# EAGLE schematic dc26 (EAGLE 9.0.1)

## Sheet 1 of 7
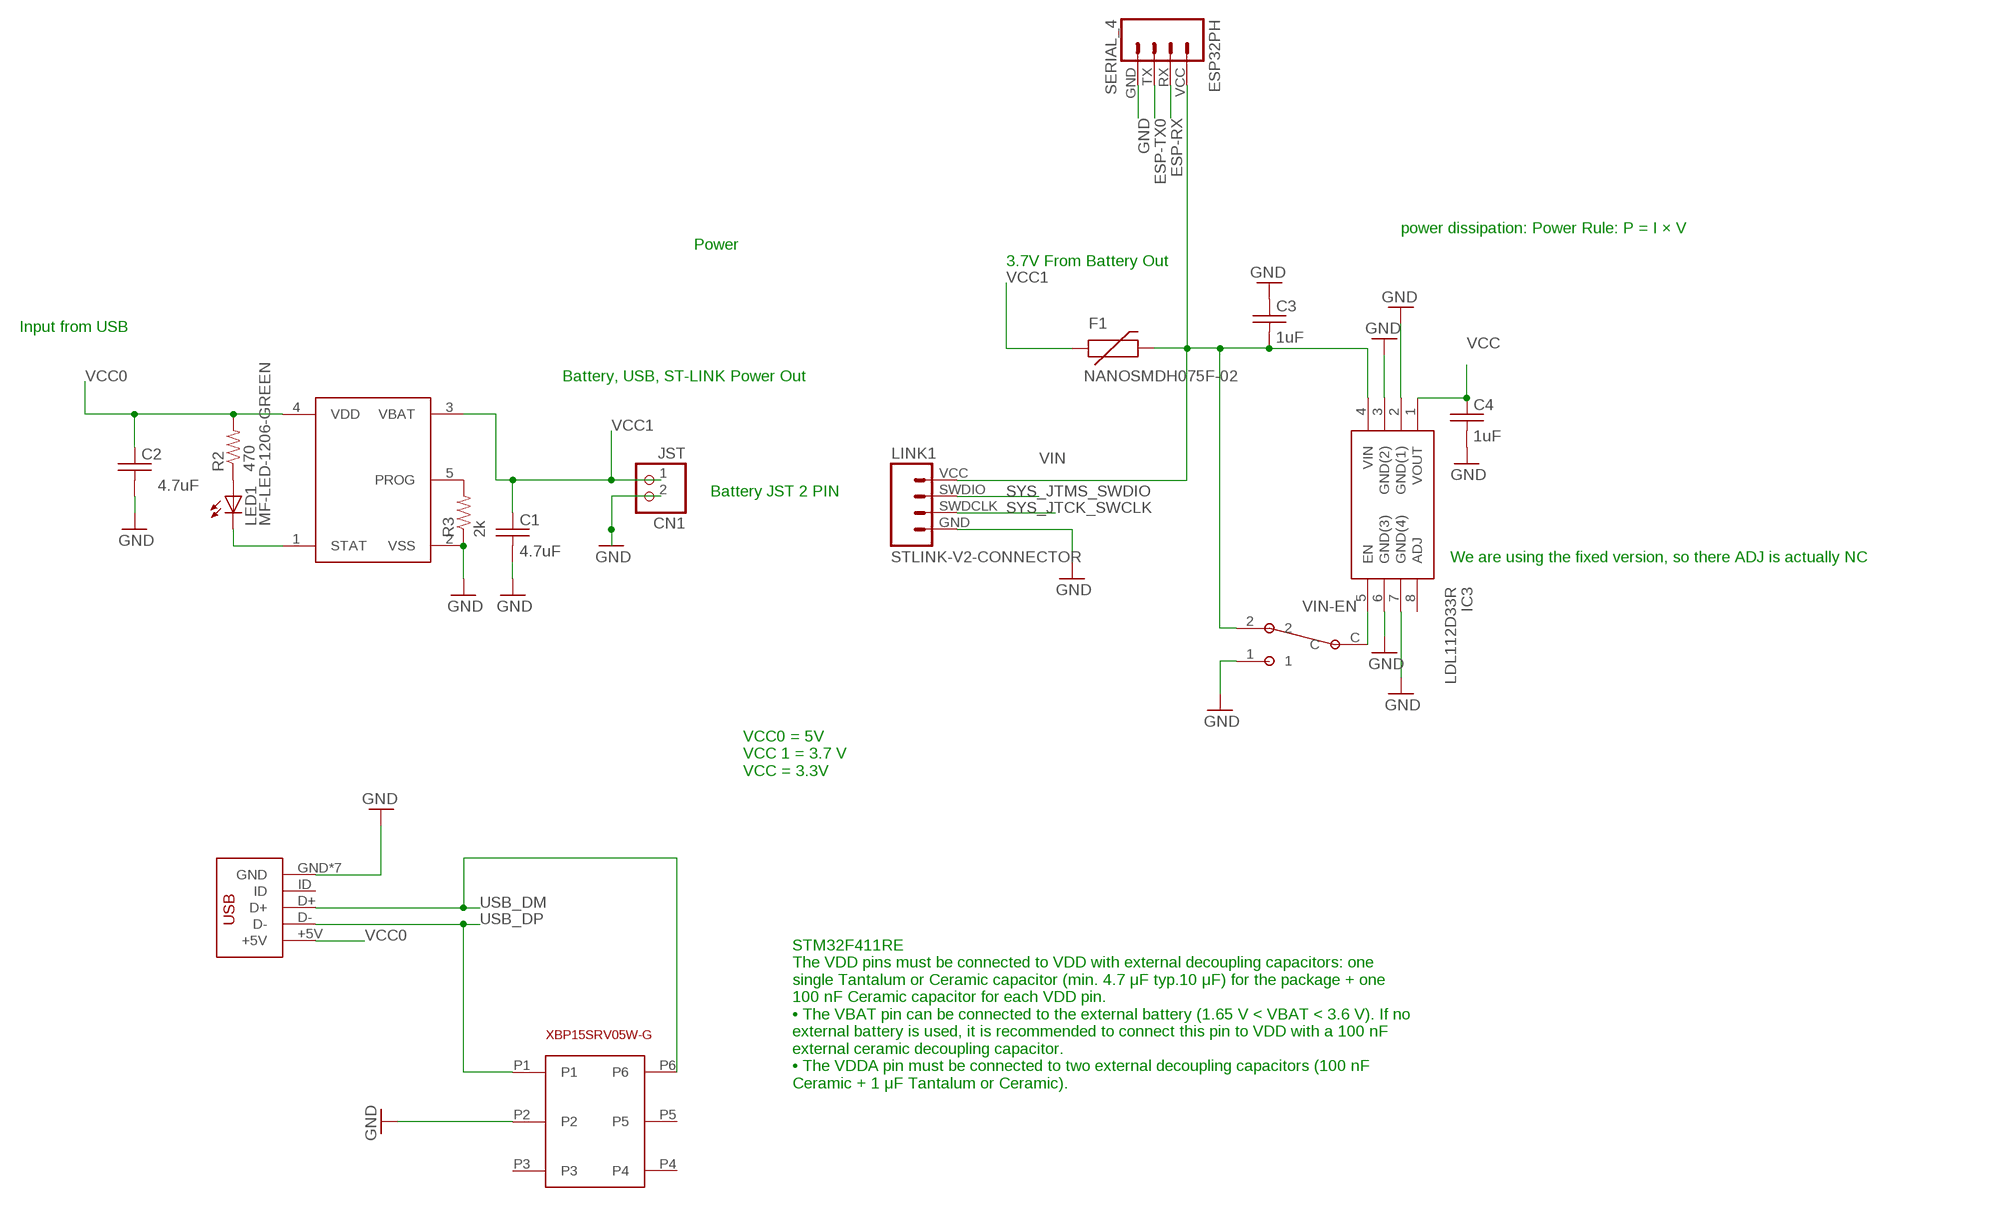
[diagram p0: schematic, sheet 1]

### Parts
C1  4.7uF  C-USC0805  [C0805]
C2  4.7uF  C-USC0805  [C0805]
C3  1uF  C-USC0805  [C0805]
C4  1uF  C-USC0805  [C0805]
CHARGE  MCP73831  DS21984E  [SOT23-5]
CN1  JST  JST_2PIN-THM-RA  [JST-PH-2-THM-RA]
ESP32PH  SERIAL_4  [SERIAL_HEADER_4]
F1  NANOSMDH075F-02  PTCSMD  [PTC-1206]
IC3  LDL112D33R  [SOIC127P600X175-8N]
LED1  MF-LED-1206-GREEN  LED1206  [LED-1206]
LINK1  STLINK-V2-CONNECTOR  [1X04]
P1  SPDT_SSAJ120100  SWITCH_SPDT  [SPDT_SSAJ120100]
R2  470  RESISTOR0805-RES  [0805]
R3  2k  RESISTOR0805-RES  [0805]
U$17  XBP15SRV05W-G  [SOT-26P-XBP15SRV05W-G]
USB  DX4R005JJ2DX4R005JJ2  [DX4R005JJ2]

### Nets
ESP-RX: ESP32PH.RX ; also sheet 4
ESP-TX0: ESP32PH.TX ; also sheet 4
GND: C1.2 C2.2 C3.1 C4.2 CHARGE.2(VSS) CN1.2 ESP32PH.GND IC3.2(GND(1)) IC3.3(GND(2)) IC3.6(GND(3)) IC3.7(GND(4)) LINK1.GND P1.1 R3.1 U$17.P2 USB.GND USB.P$6(GND) USB.P$7(GND) USB.P$8(GND) USB.P$9(GND) USB.P$10(GND) USB.P$11(GND) ; also sheet 2,3,4,5
N$1: LED1.A R2.1
N$2: CHARGE.5(PROG) R3.2
N$3: CHARGE.1(STAT) LED1.C
SYS_JTCK_SWCLK: LINK1.SWDCLK ; also sheet 2
SYS_JTMS_SWDIO: LINK1.SWDIO ; also sheet 2
USB_DM: U$17.P6 USB.D+ ; also sheet 2
USB_DP: U$17.P1 USB.D- ; also sheet 2
VCC: C4.1 IC3.1(VOUT) ; also sheet 2,4,5
VCC0: C2.1 CHARGE.4(VDD) R2.2 USB.+5V
VCC1: C1.1 CHARGE.3(VBAT) CN1.1 F1.1 ; also sheet 4
VIN: C3.2 ESP32PH.VCC F1.2 IC3.4(VIN) LINK1.VCC P1.2 ; also sheet 4
VIN-EN: IC3.5(EN) P1.C ; also sheet 3
Unconnected: IC3.8(ADJ) U$17.P3 U$17.P4 U$17.P5 USB.ID

### Notes on the sheet
- power dissipation: Power Rule: P = I × V
- Power
- 3.7V From Battery Out
- Input from USB
- Battery, USB, ST-LINK Power Out
- Battery JST 2 PIN
- We are using the fixed version, so there ADJ is actually NC
- VCC0 = 5V
  VCC 1 = 3.7 V
  VCC = 3.3V
- STM32F411RE
  The VDD pins must be connected to VDD with external decoupling capacitors: one
  single Tantalum or Ceramic capacitor (min. 4.7 μF typ.10 μF) for the package + one
  100 nF Ceramic capacitor for each VDD pin.
  • The VBAT pin can be connected to the external battery (1.65 V < VBAT < 3.6 V). If no
  external battery is used, it is recommended to connect this pin to VDD with a 100 nF
  external ceramic decoupling capacitor.
  • The VDDA pin must be connected to two external decoupling capacitors (100 nF
  Ceramic + 1 μF Tantalum or Ceramic).

## Sheet 2 of 7
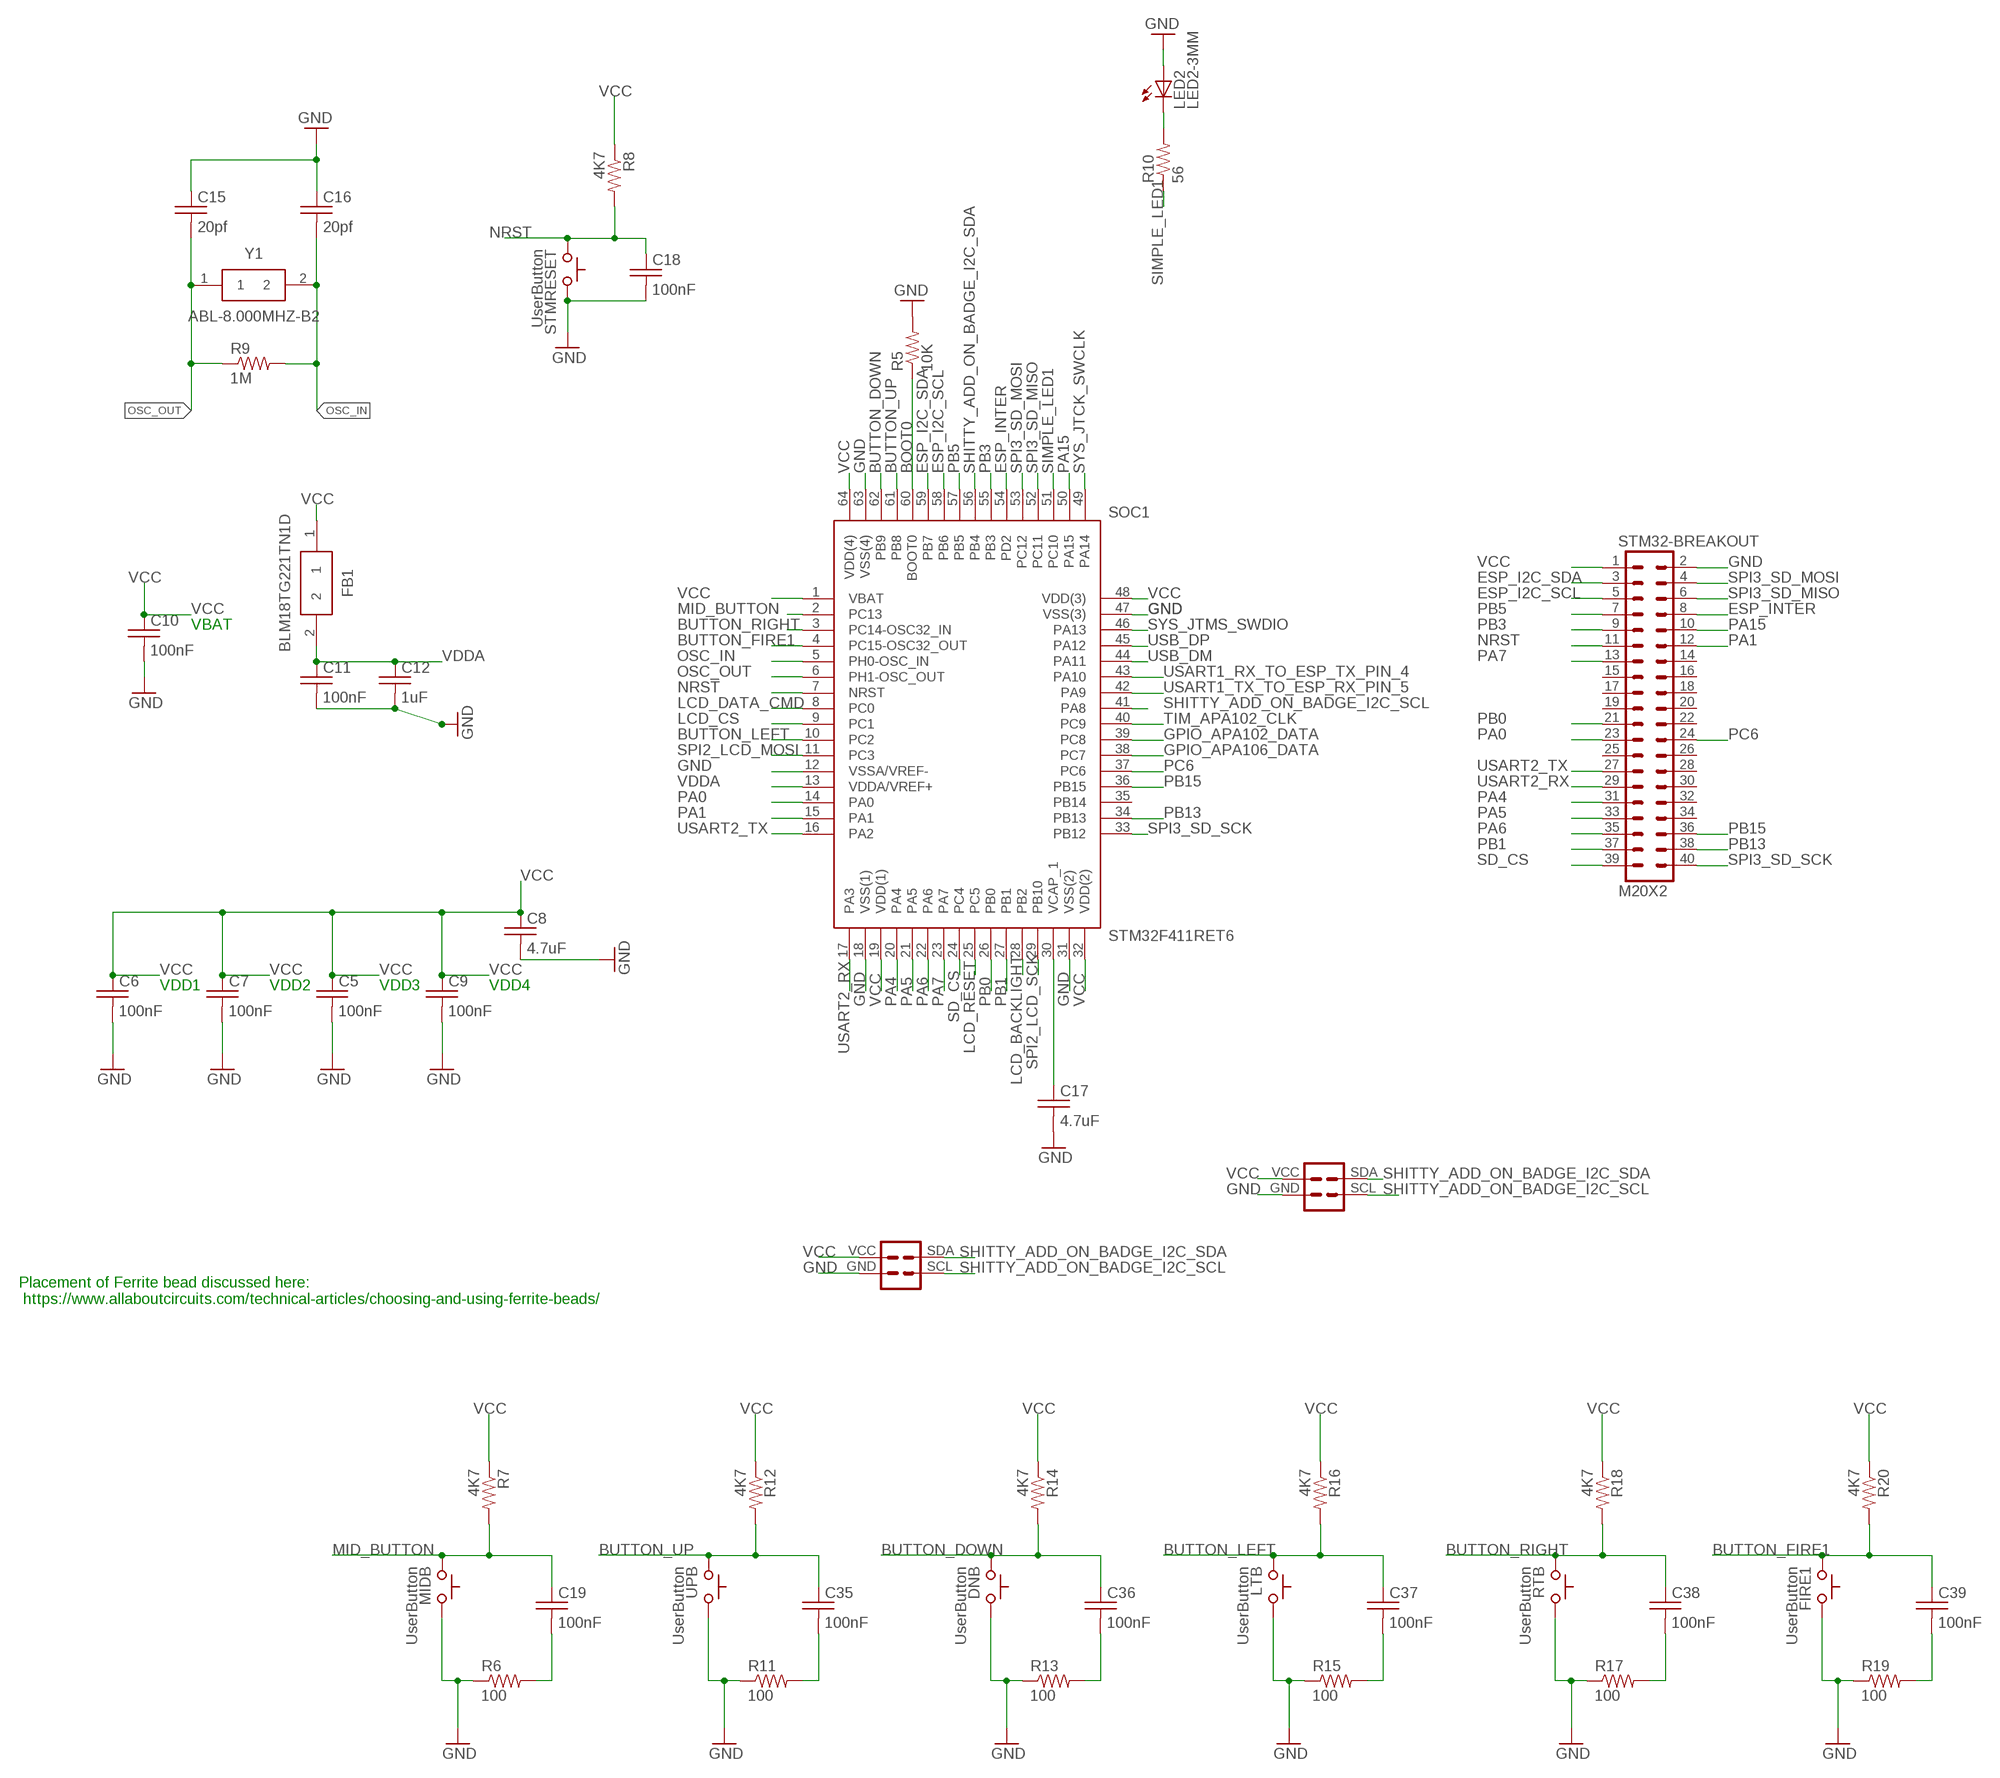
[diagram p1: schematic, sheet 2]

### Parts
C5  100nF  C-USC0805  [C0805]
C6  100nF  C-USC0805  [C0805]
C7  100nF  C-USC0805  [C0805]
C8  4.7uF  C-USC0805  [C0805]
C9  100nF  C-USC0805  [C0805]
C10  100nF  C-USC0805  [C0805]
C11  100nF  C-USC0805  [C0805]
C12  1uF  C-USC0805  [C0805]
C15  20pf  C-USC0805  [C0805]
C16  20pf  C-USC0805  [C0805]
C17  4.7uF  C-USC0805  [C0805]
C18  100nF  C-USC0805  [C0805]
C19  100nF  C-USC0805  [C0805]
C35  100nF  C-USC0805  [C0805]
C36  100nF  C-USC0805  [C0805]
C37  100nF  C-USC0805  [C0805]
C38  100nF  C-USC0805  [C0805]
C39  100nF  C-USC0805  [C0805]
DNB  UserButton  SWITCH_TACTILETACTILE-2PIN-NARROW  [TACTILE-2PIN-NARROW]
FB1  BLM18TG221TN1D  [BEADC1608X75N]
FIRE1  UserButton  SWITCH_TACTILETACTILE-2PIN-NARROW  [TACTILE-2PIN-NARROW]
J1  DC26 Shitty AddOn  DC26_SHITTY_ADDON_CONNECTORPTH  [DC26SHITTY_ADDON_CONNECTOR]
J2  DC26 Shitty AddOn  DC26_SHITTY_ADDON_CONNECTORPTH  [DC26SHITTY_ADDON_CONNECTOR]
LED2  LED2-3MM  LED3MM  [LED3MM]
LTB  UserButton  SWITCH_TACTILETACTILE-2PIN-NARROW  [TACTILE-2PIN-NARROW]
MIDB  UserButton  SWITCH_TACTILETACTILE-2PIN-NARROW  [TACTILE-2PIN-NARROW]
R5  10K  RESISTOR0805-RES  [0805]
R6  100  RESISTOR0805-RES  [0805]
R7  4K7  RESISTOR0805-RES  [0805]
R8  4K7  RESISTOR0805-RES  [0805]
R9  1M  RESISTOR0805-RES  [0805]
R10  56  RESISTOR0805-RES  [0805]
R11  100  RESISTOR0805-RES  [0805]
R12  4K7  RESISTOR0805-RES  [0805]
R13  100  RESISTOR0805-RES  [0805]
R14  4K7  RESISTOR0805-RES  [0805]
R15  100  RESISTOR0805-RES  [0805]
R16  4K7  RESISTOR0805-RES  [0805]
R17  100  RESISTOR0805-RES  [0805]
R18  4K7  RESISTOR0805-RES  [0805]
R19  100  RESISTOR0805-RES  [0805]
R20  4K7  RESISTOR0805-RES  [0805]
RTB  UserButton  SWITCH_TACTILETACTILE-2PIN-NARROW  [TACTILE-2PIN-NARROW]
SOC1  STM32F411RET6  [QFP50P1200X1200X160-64N]
STM32-BREAKOUT  M20X2  [2X20]
STMRESET  UserButton  SWITCH_TACTILETACTILE-2PIN-NARROW  [TACTILE-2PIN-NARROW]
UPB  UserButton  SWITCH_TACTILETACTILE-2PIN-NARROW  [TACTILE-2PIN-NARROW]
Y1  ABL-8.000MHZ-B2  [HC/49US_(AT49)PTH]

### Nets
BOOT0: R5.1 SOC1.60(BOOT0)
BUTTON_DOWN: C36.1 DNB.P$2(C) R14.2 SOC1.62(PB9)
BUTTON_FIRE1: C39.1 FIRE1.P$2(C) R20.2 SOC1.4(PC15-OSC32_OUT)
BUTTON_LEFT: C37.1 LTB.P$2(C) R16.2 SOC1.10(PC2)
BUTTON_RIGHT: C38.1 R18.2 RTB.P$2(C) SOC1.3(PC14-OSC32_IN)
BUTTON_UP: C35.1 R12.2 SOC1.61(PB8) UPB.P$2(C)
ESP_I2C_SCL: SOC1.58(PB6) STM32-BREAKOUT.5 ; also sheet 4,5
ESP_I2C_SDA: SOC1.59(PB7) STM32-BREAKOUT.3 ; also sheet 4,5
ESP_INTER: SOC1.54(PD2) STM32-BREAKOUT.8 ; also sheet 4
GND: C5.2 C6.2 C7.2 C8.2 C9.2 C10.2 C11.2 C12.2 C15.1 C16.1 C17.2 C18.2 DNB.P$1(A) FIRE1.P$1(A) J1.GND J2.GND LED2.A LTB.P$1(A) MIDB.P$1(A) R5.2 R6.1 R11.1 R13.1 R15.1 R17.1 R19.1 RTB.P$1(A) SOC1.12(VSSA/VREF-) SOC1.18(VSS(1)) SOC1.31(VSS(2)) SOC1.47(VSS(3)) SOC1.63(VSS(4)) STM32-BREAKOUT.2 STMRESET.P$1(A) UPB.P$1(A) ; also sheet 1,3,4,5
GPIO_APA102_DATA: SOC1.39(PC8) ; also sheet 3
GPIO_APA106_DATA: SOC1.38(PC7) ; also sheet 3
LCD_BACKLIGHT: SOC1.28(PB2) ; also sheet 5
LCD_CS: SOC1.9(PC1) ; also sheet 5
LCD_DATA_CMD: SOC1.8(PC0) ; also sheet 5
LCD_RESET: SOC1.25(PC5) ; also sheet 5
MID_BUTTON: C19.1 MIDB.P$2(C) R7.2 SOC1.2(PC13)
N$4: C19.2 R6.2
N$20: C17.1 SOC1.30(VCAP_1)
N$36: LED2.K(C) R10.2
N$37: C35.2 R11.2
N$38: C36.2 R13.2
N$39: C37.2 R15.2
N$40: C38.2 R17.2
N$41: C39.2 R19.2
NRST: C18.1 R8.2 SOC1.7(NRST) STM32-BREAKOUT.11 STMRESET.P$2(C)
OSC_IN: C16.2 R9.2 SOC1.5(PH0-OSC_IN) Y1.2
OSC_OUT: C15.2 R9.1 SOC1.6(PH1-OSC_OUT) Y1.1
PA0: SOC1.14(PA0) STM32-BREAKOUT.23
PA1: SOC1.15(PA1) STM32-BREAKOUT.12
PA4: SOC1.20(PA4) STM32-BREAKOUT.31
PA5: SOC1.21(PA5) STM32-BREAKOUT.33
PA6: SOC1.22(PA6) STM32-BREAKOUT.35
PA7: SOC1.23(PA7) STM32-BREAKOUT.13
PA15: SOC1.50(PA15) STM32-BREAKOUT.10
PB0: SOC1.26(PB0) STM32-BREAKOUT.21
PB1: SOC1.27(PB1) STM32-BREAKOUT.37
PB3: SOC1.55(PB3) STM32-BREAKOUT.9
PB5: SOC1.57(PB5) STM32-BREAKOUT.7
PB13: SOC1.34(PB13) STM32-BREAKOUT.38
PB15: SOC1.36(PB15) STM32-BREAKOUT.36
PC6: SOC1.37(PC6) STM32-BREAKOUT.24
SD_CS: SOC1.24(PC4) STM32-BREAKOUT.39 ; also sheet 5
SHITTY_ADD_ON_BADGE_I2C_SCL: J1.SCL J2.SCL SOC1.41(PA8)
SHITTY_ADD_ON_BADGE_I2C_SDA: J1.SDA J2.SDA SOC1.56(PB4)
SIMPLE_LED1: R10.1 SOC1.51(PC10)
SPI2_LCD_MOSI: SOC1.11(PC3) ; also sheet 5
SPI2_LCD_SCK: SOC1.29(PB10) ; also sheet 5
SPI3_SD_MISO: SOC1.52(PC11) STM32-BREAKOUT.6 ; also sheet 5
SPI3_SD_MOSI: SOC1.53(PC12) STM32-BREAKOUT.4 ; also sheet 5
SPI3_SD_SCK: SOC1.33(PB12) STM32-BREAKOUT.40 ; also sheet 5
SYS_JTCK_SWCLK: SOC1.49(PA14) ; also sheet 1
SYS_JTMS_SWDIO: SOC1.46(PA13) ; also sheet 1
TIM_APA102_CLK: SOC1.40(PC9) ; also sheet 3
USART1_RX_TO_ESP_TX_PIN_4: SOC1.43(PA10) ; also sheet 4
USART1_TX_TO_ESP_RX_PIN_5: SOC1.42(PA9) ; also sheet 4
USART2_RX: SOC1.17(PA3) STM32-BREAKOUT.29
USART2_TX: SOC1.16(PA2) STM32-BREAKOUT.27
USB_DM: SOC1.44(PA11) ; also sheet 1
USB_DP: SOC1.45(PA12) ; also sheet 1
VCC: C5.1 C6.1 C7.1 C8.1 C9.1 C10.1 FB1.1 J1.VCC J2.VCC R7.1 R8.1 R12.1 R14.1 R16.1 R18.1 R20.1 SOC1.1(VBAT) SOC1.19(VDD(1)) SOC1.32(VDD(2)) SOC1.48(VDD(3)) SOC1.64(VDD(4)) STM32-BREAKOUT.1 ; also sheet 1,4,5
VDDA: C11.1 C12.1 FB1.2 SOC1.13(VDDA/VREF+)
Unconnected: SOC1.35(PB14) STM32-BREAKOUT.14 STM32-BREAKOUT.15 STM32-BREAKOUT.16 STM32-BREAKOUT.17 STM32-BREAKOUT.18 STM32-BREAKOUT.19 STM32-BREAKOUT.20 STM32-BREAKOUT.22 STM32-BREAKOUT.25 STM32-BREAKOUT.26 STM32-BREAKOUT.28 STM32-BREAKOUT.30 STM32-BREAKOUT.32 STM32-BREAKOUT.34

### Notes on the sheet
- VBAT
- VDD1 | VDD2 | VDD3 | VDD4
- Placement of Ferrite bead discussed here: 
   https://www.allaboutcircuits.com/technical-articles/choosing-and-using-ferrite-beads/

## Sheet 3 of 7
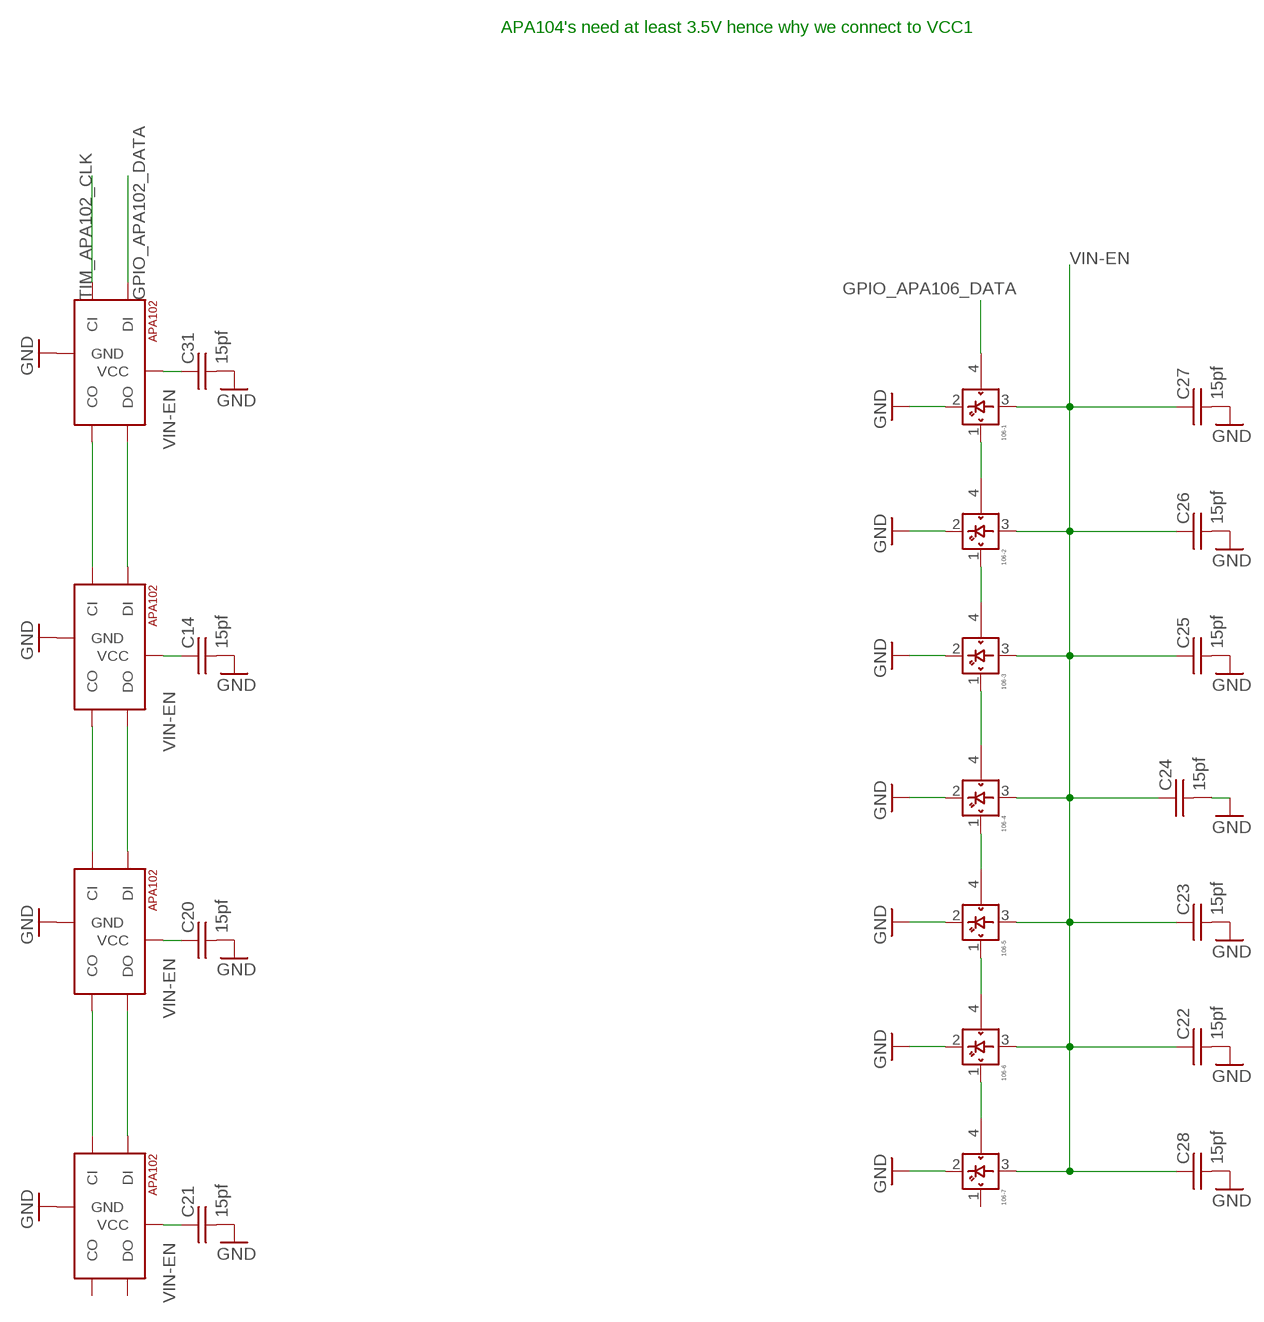
[diagram p2: schematic, sheet 3]

### Parts
102-1  APA1025050  [APA102_5050]
102-2  APA1025050  [APA102_5050]
102-3  APA1025050  [APA102_5050]
102-4  APA1025050  [APA102_5050]
106-1  APA-106  [WS2812F5_STRAIGHT]
106-2  APA-106  [WS2812F5_STRAIGHT]
106-3  APA-106  [WS2812F5_STRAIGHT]
106-4  APA-106  [WS2812F5_STRAIGHT]
106-5  APA-106  [WS2812F5_STRAIGHT]
106-6  APA-106  [WS2812F5_STRAIGHT]
106-7  APA-106  [WS2812F5_STRAIGHT]
C14  15pf  C-USC0805  [C0805]
C20  15pf  C-USC0805  [C0805]
C21  15pf  C-USC0805  [C0805]
C22  15pf  C-USC0805  [C0805]
C23  15pf  C-USC0805  [C0805]
C24  15pf  C-USC0805  [C0805]
C25  15pf  C-USC0805  [C0805]
C26  15pf  C-USC0805  [C0805]
C27  15pf  C-USC0805  [C0805]
C28  15pf  C-USC0805  [C0805]
C31  15pf  C-USC0805  [C0805]

### Nets
GND: 102-1.6(GND) 102-2.6(GND) 102-3.6(GND) 102-4.6(GND) 106-1.2(GND) 106-2.2(GND) 106-3.2(GND) 106-4.2(GND) 106-5.2(GND) 106-6.2(GND) 106-7.2(GND) C14.2 C20.2 C21.2 C22.2 C23.2 C24.2 C25.2 C26.2 C27.2 C28.2 C31.2 ; also sheet 1,2,4,5
GPIO_APA102_DATA: 102-1.4(DI) ; also sheet 2
GPIO_APA106_DATA: 106-1.4(DIN) ; also sheet 2
N$5: 102-1.2(CO) 102-2.5(CI)
N$6: 102-2.2(CO) 102-3.5(CI)
N$7: 102-3.2(CO) 102-4.5(CI)
N$8: 102-3.3(DO) 102-4.4(DI)
N$9: 102-2.3(DO) 102-3.4(DI)
N$10: 102-1.3(DO) 102-2.4(DI)
N$11: 106-1.1(DOUT) 106-2.4(DIN)
N$12: 106-2.1(DOUT) 106-3.4(DIN)
N$13: 106-3.1(DOUT) 106-4.4(DIN)
N$14: 106-4.1(DOUT) 106-5.4(DIN)
N$15: 106-5.1(DOUT) 106-6.4(DIN)
N$17: 106-6.1(DOUT) 106-7.4(DIN)
TIM_APA102_CLK: 102-1.5(CI) ; also sheet 2
VIN-EN: 102-1.1(VCC) 102-2.1(VCC) 102-3.1(VCC) 102-4.1(VCC) 106-1.3(VDD) 106-2.3(VDD) 106-3.3(VDD) 106-4.3(VDD) 106-5.3(VDD) 106-6.3(VDD) 106-7.3(VDD) C14.1 C20.1 C21.1 C22.1 C23.1 C24.1 C25.1 C26.1 C27.1 C28.1 C31.1 ; also sheet 1
Unconnected: 102-4.2(CO) 102-4.3(DO) 106-7.1(DOUT)

### Notes on the sheet
- APA104's need at least 3.5V hence why we connect to VCC1

## Sheet 4 of 7
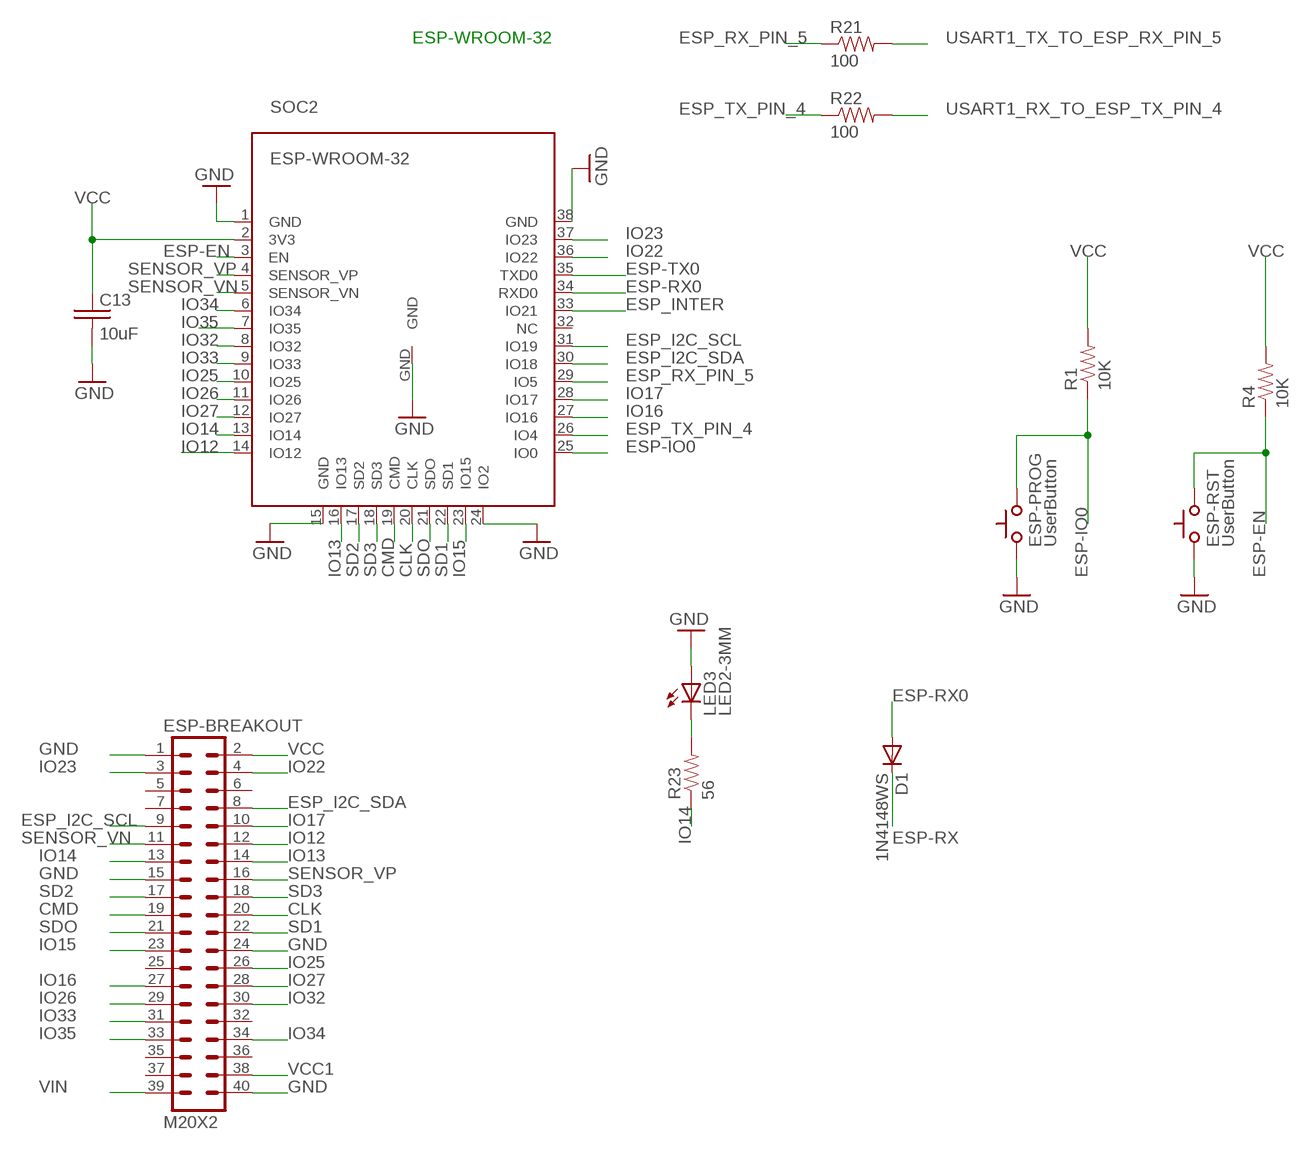
[diagram p3: schematic, sheet 4]

### Parts
C13  10uF  C-USC0805  [C0805]
D1  1N4148WS  DIODESOD  [SOD-323]
ESP-BREAKOUT  M20X2  [2X20]
ESP-PROG  UserButton  SWITCH_TACTILETACTILE-2PIN-NARROW  [TACTILE-2PIN-NARROW]
ESP-RST  UserButton  SWITCH_TACTILETACTILE-2PIN-NARROW  [TACTILE-2PIN-NARROW]
LED3  LED2-3MM  LED3MM  [LED3MM]
R1  10K  RESISTOR0805-RES  [0805]
R4  10K  RESISTOR0805-RES  [0805]
R21  100  RESISTOR0805-RES  [0805]
R22  100  RESISTOR0805-RES  [0805]
R23  56  RESISTOR0805-RES  [0805]
SOC2  ESP-WROOM-32  [ESP-WROOM-32]

### Nets
CLK: ESP-BREAKOUT.20 SOC2.20(CLK)
CMD: ESP-BREAKOUT.19 SOC2.19(CMD)
ESP-EN: ESP-RST.P$1(A) R4.1 SOC2.3(EN)
ESP-IO0: ESP-PROG.P$1(A) R1.1 SOC2.25(IO0)
ESP-RX: D1.1(C) ; also sheet 1
ESP-RX0: D1.2(A) SOC2.34(RXD0)
ESP-TX0: SOC2.35(TXD0) ; also sheet 1
ESP_I2C_SCL: ESP-BREAKOUT.9 SOC2.31(IO19) ; also sheet 2,5
ESP_I2C_SDA: ESP-BREAKOUT.8 SOC2.30(IO18) ; also sheet 2,5
ESP_INTER: SOC2.33(IO21) ; also sheet 2
ESP_RX_PIN_5: R21.1 SOC2.29(IO5)
ESP_TX_PIN_4: R22.1 SOC2.26(IO4)
GND: C13.2 ESP-BREAKOUT.1 ESP-BREAKOUT.15 ESP-BREAKOUT.24 ESP-BREAKOUT.40 ESP-PROG.P$2(C) ESP-RST.P$2(C) LED3.A SOC2.1(GND) SOC2.15(GND) SOC2.24(IO2) SOC2.38(GND) SOC2.GND ; also sheet 1,2,3,5
IO12: ESP-BREAKOUT.12 SOC2.14(IO12)
IO13: ESP-BREAKOUT.14 SOC2.16(IO13)
IO14: ESP-BREAKOUT.13 R23.1 SOC2.13(IO14)
IO15: ESP-BREAKOUT.23 SOC2.23(IO15)
IO16: ESP-BREAKOUT.27 SOC2.27(IO16)
IO17: ESP-BREAKOUT.10 SOC2.28(IO17)
IO22: ESP-BREAKOUT.4 SOC2.36(IO22)
IO23: ESP-BREAKOUT.3 SOC2.37(IO23)
IO25: ESP-BREAKOUT.26 SOC2.10(IO25)
IO26: ESP-BREAKOUT.29 SOC2.11(IO26)
IO27: ESP-BREAKOUT.28 SOC2.12(IO27)
IO32: ESP-BREAKOUT.30 SOC2.8(IO32)
IO33: ESP-BREAKOUT.31 SOC2.9(IO33)
IO34: ESP-BREAKOUT.34 SOC2.6(IO34)
IO35: ESP-BREAKOUT.33 SOC2.7(IO35)
N$16: LED3.K(C) R23.2
SD1: ESP-BREAKOUT.22 SOC2.22(SD1)
SD2: ESP-BREAKOUT.17 SOC2.17(SD2)
SD3: ESP-BREAKOUT.18 SOC2.18(SD3)
SDO: ESP-BREAKOUT.21 SOC2.21(SDO)
SENSOR_VN: ESP-BREAKOUT.11 SOC2.5(SENSOR_VN)
SENSOR_VP: ESP-BREAKOUT.16 SOC2.4(SENSOR_VP)
USART1_RX_TO_ESP_TX_PIN_4: R22.2 ; also sheet 2
USART1_TX_TO_ESP_RX_PIN_5: R21.2 ; also sheet 2
VCC: C13.1 ESP-BREAKOUT.2 R1.2 R4.2 SOC2.2(3V3) ; also sheet 1,2,5
VCC1: ESP-BREAKOUT.38 ; also sheet 1
VIN: ESP-BREAKOUT.39 ; also sheet 1
Unconnected: ESP-BREAKOUT.5 ESP-BREAKOUT.6 ESP-BREAKOUT.7 ESP-BREAKOUT.25 ESP-BREAKOUT.32 ESP-BREAKOUT.35 ESP-BREAKOUT.36 ESP-BREAKOUT.37 SOC2.32(NC)

### Notes on the sheet
- ESP-WROOM-32

## Sheet 5 of 7
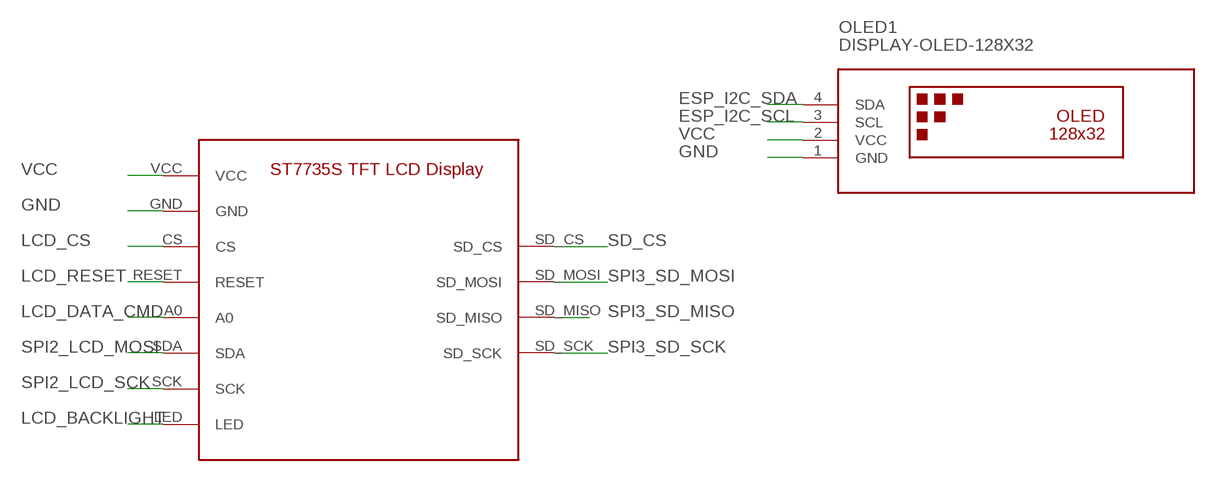
[diagram p4: schematic, sheet 5]

### Parts
LCD1  ST7735S_LCD_MODULE  [ST7735S_LCD_DISPLAY]
OLED1  DISPLAY-OLED-128X32  [DISPLAY-OLED-128X32]

### Nets
ESP_I2C_SCL: OLED1.3(SCL) ; also sheet 2,4
ESP_I2C_SDA: OLED1.4(SDA) ; also sheet 2,4
GND: LCD1.GND OLED1.1(GND) ; also sheet 1,2,3,4
LCD_BACKLIGHT: LCD1.LED ; also sheet 2
LCD_CS: LCD1.CS ; also sheet 2
LCD_DATA_CMD: LCD1.A0 ; also sheet 2
LCD_RESET: LCD1.RESET ; also sheet 2
SD_CS: LCD1.SD_CS ; also sheet 2
SPI2_LCD_MOSI: LCD1.SDA ; also sheet 2
SPI2_LCD_SCK: LCD1.SCK ; also sheet 2
SPI3_SD_MISO: LCD1.SD_MISO ; also sheet 2
SPI3_SD_MOSI: LCD1.SD_MOSI ; also sheet 2
SPI3_SD_SCK: LCD1.SD_SCK ; also sheet 2
VCC: LCD1.VCC OLED1.2(VCC) ; also sheet 1,2,4

## Sheet 6 of 7
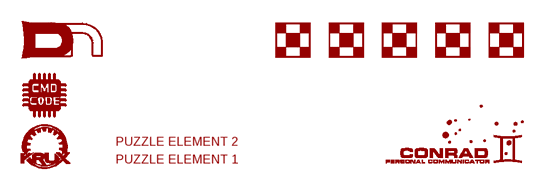
[diagram p5: schematic, sheet 6]

### Parts
U$1  KRUX_LOGO  [KRUX_LOGO]
U$2  CMD_C0DE_LOGO  [CMD_C0DE_LOGO]
U$3  DC26_KRUX_PUZZLE_1  [DN26_KRUX_PUZZLE_1]
U$4  DC26_KRUX_PUZZLE_2  [DN26_KRUX_PUZZLE_2]
U$5  CONRAD_LOGO  [CONRAD_LOGO]
U$6  DN_LOGODC26  [DN_LOGO_DC26]
U$7  FIDUCIAL_DNBOX  [FIDUCIAL_BOX]
U$8  FIDUCIAL_DNBOX  [FIDUCIAL_BOX]
U$9  FIDUCIAL_DNCORNER  [FIDUCIAL_CORNER]
U$10  FIDUCIAL_DNCORNER  [FIDUCIAL_CORNER]
U$11  FIDUCIAL_DNCORNER  [FIDUCIAL_CORNER]

## Sheet 7 of 7
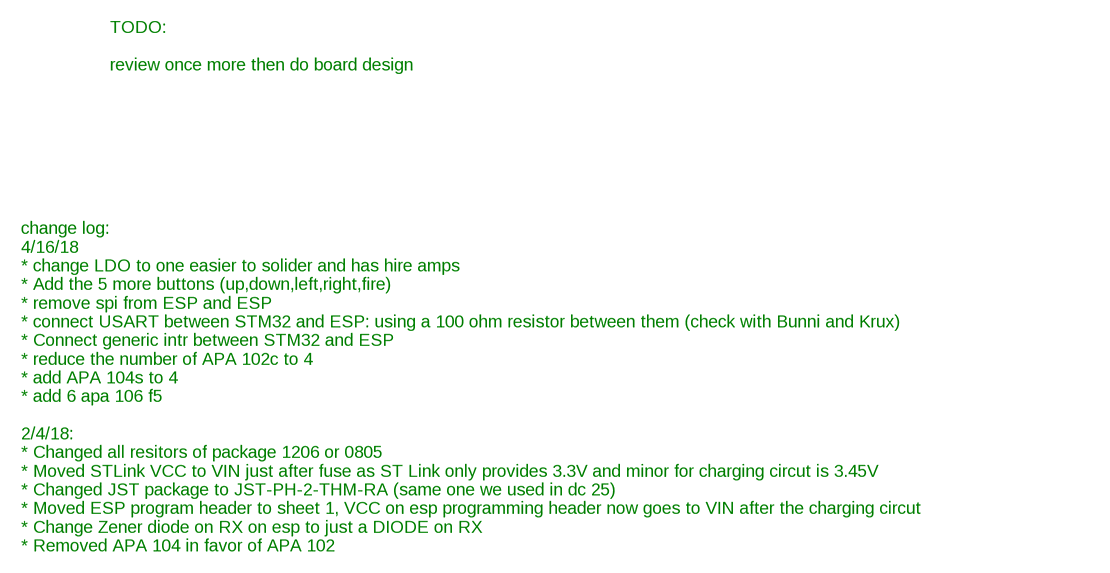
[diagram p6: schematic, sheet 7]

### Notes on the sheet
- TODO:
  
  review once more then do board design
- change log:
  4/16/18
  * change LDO to one easier to solider and has hire amps
  * Add the 5 more buttons (up,down,left,right,fire)
  * remove spi from ESP and ESP
  * connect USART between STM32 and ESP: using a 100 ohm resistor between them (check with Bunni and Krux)
  * Connect generic intr between STM32 and ESP
  * reduce the number of APA 102c to 4
  * add APA 104s to 4
  * add 6 apa 106 f5
  
  2/4/18:  
  * Changed all resitors of package 1206 or 0805
  * Moved STLink VCC to VIN just after fuse as ST Link only provides 3.3V and minor for charging circut is 3.45V
  * Changed JST package to JST-PH-2-THM-RA (same one we used in dc 25)
  * Moved ESP program header to sheet 1, VCC on esp programming header now goes to VIN after the charging circut
  * Change Zener diode on RX on esp to just a DIODE on RX 
  * Removed APA 104 in favor of APA 102

## Library data of the parts
102-1-102-4 = dc-26:APA102: APA102C 5050 RGB LED -- Adafruit DotStar Single LED Pixel Product Page: https://www.adafruit.com/products/2343 Datasheet: https://cdn-shop.adafruit.com/product-files/2343/APA102C.pdf
106-1-106-7 = dc-26:APA-106: PIN1=DOUT PIN2=GND PIN3=VCC PIN4=DIN
C1-C28 C31 C35-C39 = dc-26:C-US: CAPACITOR, American symbol
CHARGE = dc-26:DS21984E
CN1 = dc-26:JST_2PIN: JST 2-Pin Connectors of various flavors SMT-RA (S2B-PH-SM4) 4UConnector #17311 SMT (B2B-PH-SM4) THM-RA (S2B-PH) THM (B2B-PH)
D1 = dc-26:DIODE: Diode These are standard reverse protection diodes and small signal diodes. SMA package can handle up to about 1A. SOD-323 can handle about 200mA. What the SOD-323 package when ordering, there are some mfgs out there that are 5-pin packages.; PROD_ID: DIO-09646
DNB ESP-PROG ESP-RST FIRE1 LTB MIDB RTB STMRESET UPB = dc-26:SWITCH_TACTILE
ESP32PH = dc-26:SERIAL_4
ESP-BREAKOUT STM32-BREAKOUT = dc-26:M20X2: 0.1" spaced headers
F1 = dc-26:PTC: Resettable Fuse PTC Littlefuse Inc: NANOSMDH075F-02; MANUFACTURE_ID: NANOSMDH075F-02; PROD_ID: NANOSMDH075F-02
FB1 = dc-26:BLM18TG221TN1D: Ferrite bead SMD 0603 220R Murata Ferrite Bead (Chip Ferrite Bead), 1.6 x 0.8 x 0.6mm (0603), 1000 impedance at 100 MHz <https://componentsearchengine.com/Images/3/BLM18TG221TN1D.jpg> Source: Datasheet <http://www.murata.com/~/media/webrenewal/support/library/catalog/products/emc/emifil/c31e.ashx?la=en-gb>; DESCRIPTION: Ferrite bead SMD 0603 220R Murata Ferrite Bead (Chip Ferrite Bead), 1.6 x 0.8 x 0.6mm (0603), 1000 impedance at 100 MHz; HEIGHT: 0.75mm; MANUFACTURER_NAME: Murata Electronics; MANUFACTURER_PART_NUMBER: BLM18TG221TN1D; RS_PART_NUMBER: 6197526; SUPPLIER_NAME: RS
IC3 = dc-26:LDL112D33R: LDO Voltage Regulators 1.2 A low quiescent current LDO with reverse current protection Source: Datasheet <https://www.arrow.com/en/products/ldl112d33r/stmicroelectronics>; ARROW_PART_NUMBER: LDL112D33R; ARROW_PRICE/STOCK: https://www.arrow.com/en/products/ldl112d33r/stmicroelectronics; DESCRIPTION: LDO Voltage Regulators 1.2 A low quiescent current LDO with reverse current protection; HEIGHT: 1.75mm; MANUFACTURER_NAME: STMicroelectronics; MANUFACTURER_PART_NUMBER: LDL112D33R
J1 J2 = dc-26:DC26_SHITTY_ADDON_CONNECTOR: Standard 2-pin 0.1" header. Use with - straight break away headers ( PRT-00116) - right angle break away headers (PRT-00553) - swiss pins (PRT-00743) - machine pins (PRT-00117) - female headers (PRT-00115) Molex polarized connector foot print use with: PRT-08233 with associated crimp pins and housings. 2.54_SCREWTERM for use with PRT-10571. 3.5mm Screw Terminal footprints for PRT-08084 5mm Screw Terminal footprints for use with PRT-08432
LCD1 = dc-26:ST7735S_LCD_MODULE
LED1-LED3 = dc-26:LED: LEDs Standard schematic elements and footprints for 5mm, 3mm, 1206, and 0603 sized LEDs. 5mm - Spark Fun Electronics SKU : COM-00529 (and others)
LINK1 = dc-26:STLINK-V2-CONNECTOR
OLED1 = dc-26:DISPLAY-OLED-128X32: 128x32 Dot Matrix OLED Module with I2C interface based on SSD1306 chip More details available here: http://www.tinyosshop.com/index.php?route=product/product&product_id=953 Schematic available here: http://www.tinyosshop.com/datasheet/OLED%2012832.pdf SSD1306 datasheet: https://cdn-shop.adafruit.com/datasheets/SSD1306.pdf Click here to find device on ebay.com <http://www.ebay.com/sch/oled+display+128x32+i2c>
P1 = dc-26:SWITCH_SPDT
R1-R23 = dc-26:RESISTOR: Resistor Basic schematic elements and footprints for 0603, 1206, and PTH resistors.
SOC1 = STM32F411RET6:STM32F411RET6: 32-Bit MCU+DSP 512K Flash 100MHz LQFP64 STMicroelectronics STM32F411RET6, 32bit ARM Cortex M4 MCU, 100MHz, 512 kB Flash, 64-Pin LQFP <https://componentsearchengine.com/Images/1/STM32F411RET6.jpg> Source: Datasheet <http://www.farnell.com/datasheets/2042639.pdf>; DESCRIPTION: 32-Bit MCU+DSP 512K Flash 100MHz LQFP64 STMicroelectronics STM32F411RET6, 32bit ARM Cortex M4 MCU, 100MHz, 512 kB Flash, 64-Pin LQFP; HEIGHT: 1.6mm; MANUFACTURER_NAME: STMicroelectronics; MANUFACTURER_PART_NUMBER: STM32F411RET6; RS_PART_NUMBER: 1106617P; SUPPLIER_NAME: RS
SOC2 = dc-26:ESP-WROOM-32
U$1 = darknet_parts_library:KRUX_LOGO
U$2 = darknet_parts_library:CMD_C0DE_LOGO
U$3 = darknet_parts_library:DC26_KRUX_PUZZLE_1
U$4 = darknet_parts_library:DC26_KRUX_PUZZLE_2
U$5 = darknet_parts_library:CONRAD_LOGO
U$6 = darknet_parts_library:DN_LOGO
U$7-U$11 = darknet_parts_library:FIDUCIAL_DN
U$17 = dc-26:XBP15SRV05W-G: Low Capacitance TVS Diode Array (used for USB) P1->D- (usb1) P2->GND P3->D- (usb2) P4->D+ (usb2) P5->NC P6->D+(usb1) Datasheet <https://www.torexsemi.com/file/xbp15srv05w/XBP15SRV05W.pdf>; DIGI_KEY_PART_NUMBER: 893-1422-1-ND; MANUFACTURER_PART_NUMBER: XBP15SRV05W-G
USB = dc-26:DX4R005JJ2
Y1 = ABL-8.000MHZ-B2:ABL-8.000MHZ-B2: ABRACON - ABL-8.000MHZ-B2 - CRYSTAL, 8MHZ, 18PF, HC-49US <https://componentsearchengine.com/Images/9/ABL-8.000MHZ-B2.jpg> Source: Datasheet <http://www.abracon.com/Resonators/ABL.pdf>; DESCRIPTION: ABRACON - ABL-8.000MHZ-B2 - CRYSTAL, 8MHZ, 18PF, HC-49US; HEIGHT: mm; MANUFACTURER_NAME: ABRACON; MANUFACTURER_PART_NUMBER: ABL-8.000MHZ-B2; SUPPLIER_NAME: RS